# EasyEDA Pro project evenVCO.eprj, board Panel
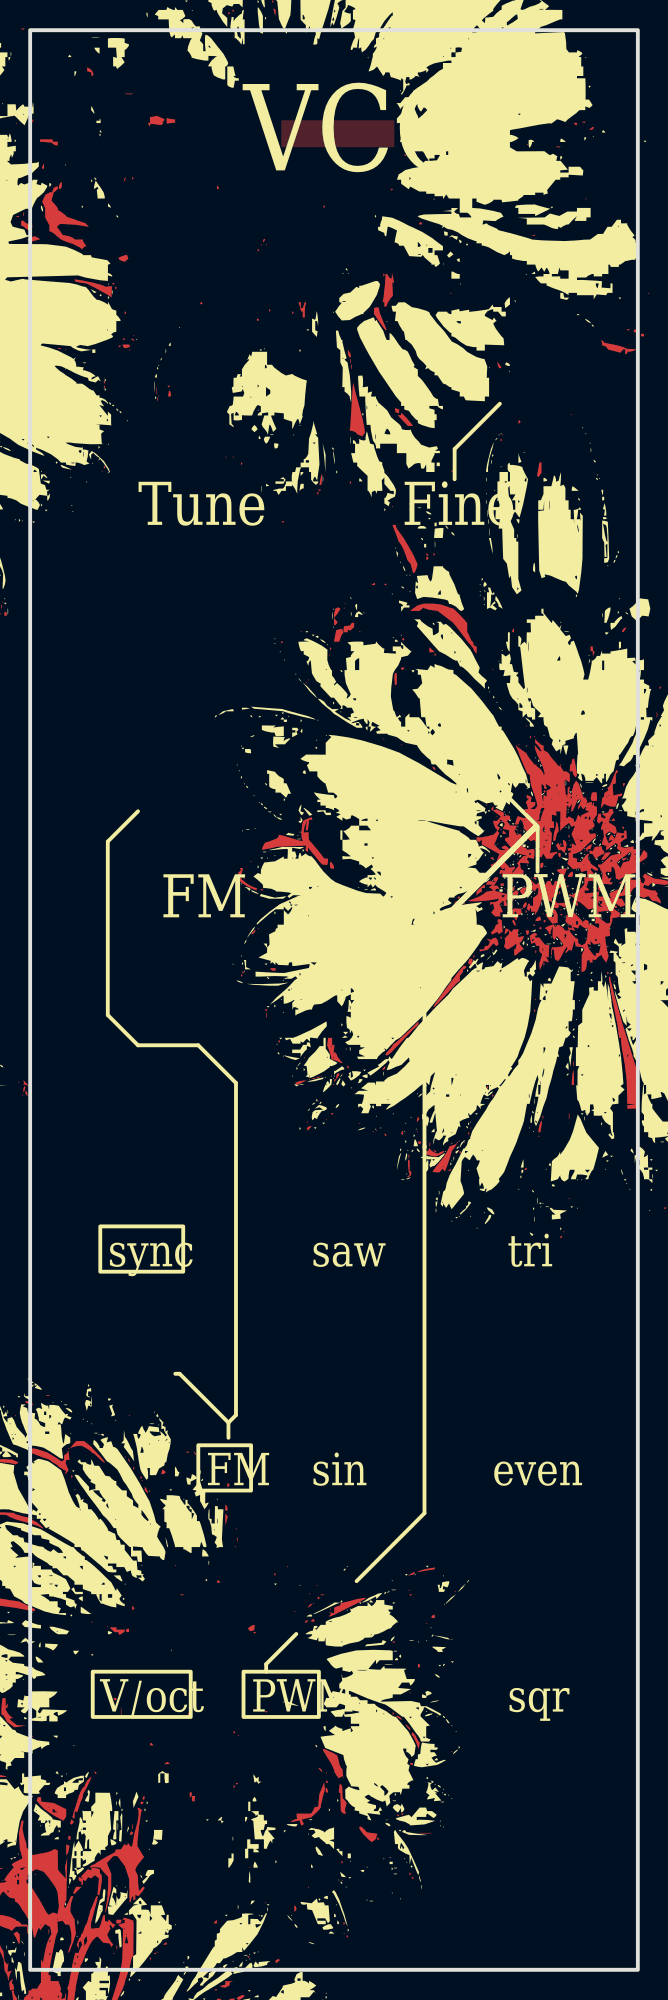
[diagram p10: board, top side]
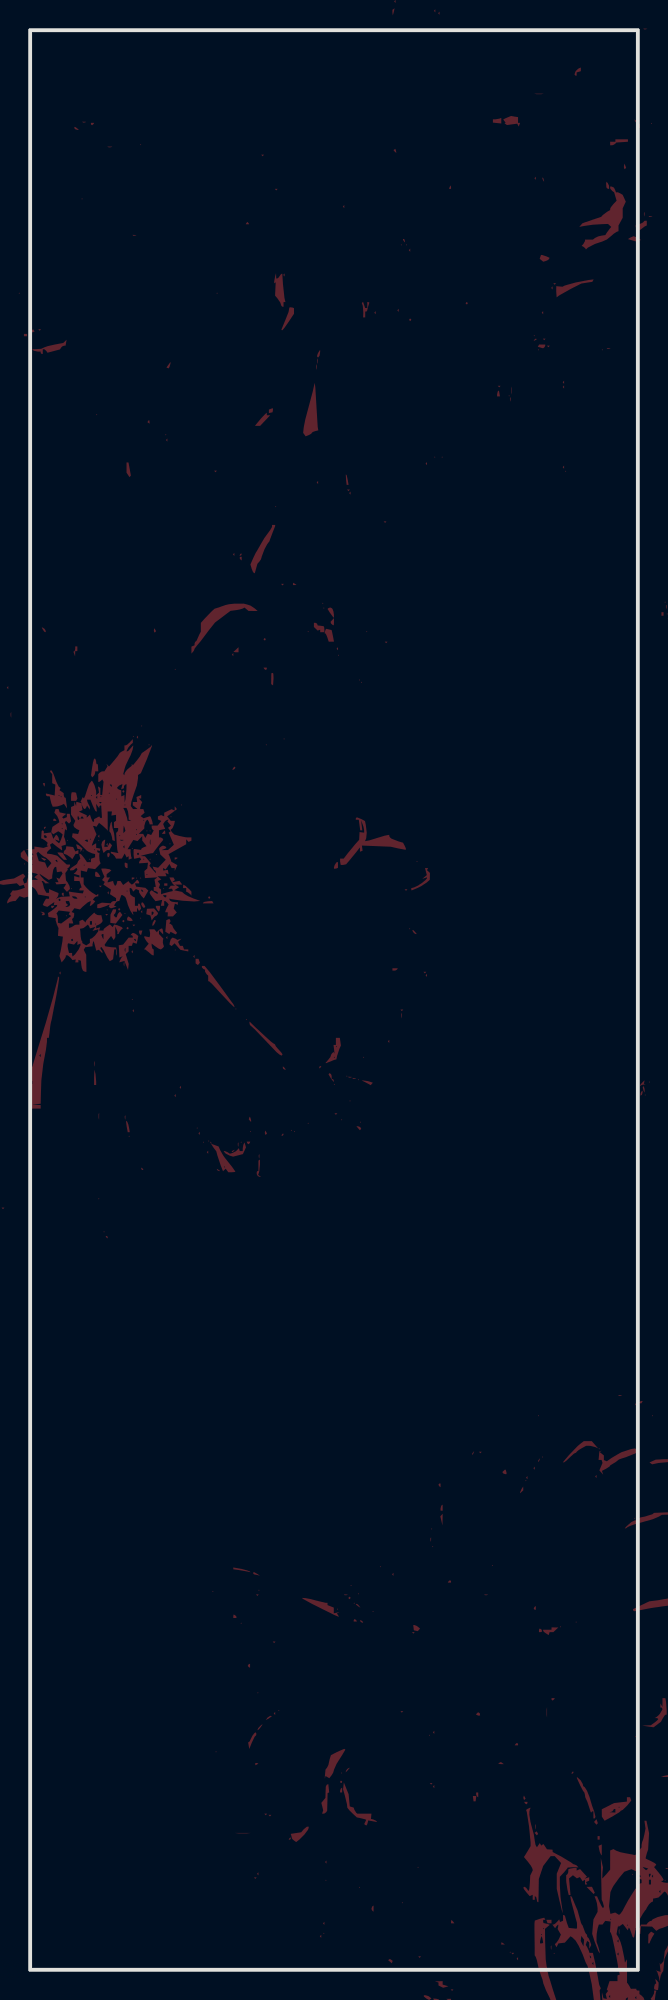
[diagram p11: board, bottom side, seen from below]

Outline 40.3 x 128.5 mm; copper layers: Top Layer, Bottom Layer. Coordinates in mm from the lower left corner of the outline.
Outline path: rectangle 0,128.5 40.3,0
Stack: Top Layer 0.035mm / Dielectric1 1.51mm FR4 er 4.5 / Bottom Layer 0.035mm

## Design rules (mm)
template: Custom Config
spacing copperThickness1oz (default): track to track 0.102, other pairs 0.152 to 0.3
spacing copperThickness2oz: track to track 0.203, other pairs 0.152 to 0.3
track width copperThickness1oz (default): min 0.127, default 0.254, max 2.54
track width copperThickness2oz: min 0.203, default 0.254, max 2.54
differential pair differentialPair (default): width min 0.127, default 0.254, max 2.54; gap min 0.152, default 0.152
via viaSize (default): diameter min 0.5, default 0.61, max 10; hole min 0.3, default 0.305, max 6.3

## Placement (name value [footprint] x y rotation side)

## Nets

## Copper pours and planes (outline as drawn; the poured copper is in the pictures)
(no net) on Top Layer: 16.65,122.52 24.15,122.52 24.15,120.75 16.65,120.75

Small or netless copper shapes (teardrops, artwork), in the pictures only: 1154 on Top Layer

## Text on the board
Top Silkscreen Layer: V/oct | sync | FM | PWM | saw | sin | even | tri | sqr | Tune | Fine | VCO
